# Altium schematic sheet MCU.SchDoc
size A4; SheetNumber: 4; SheetTotal: 6
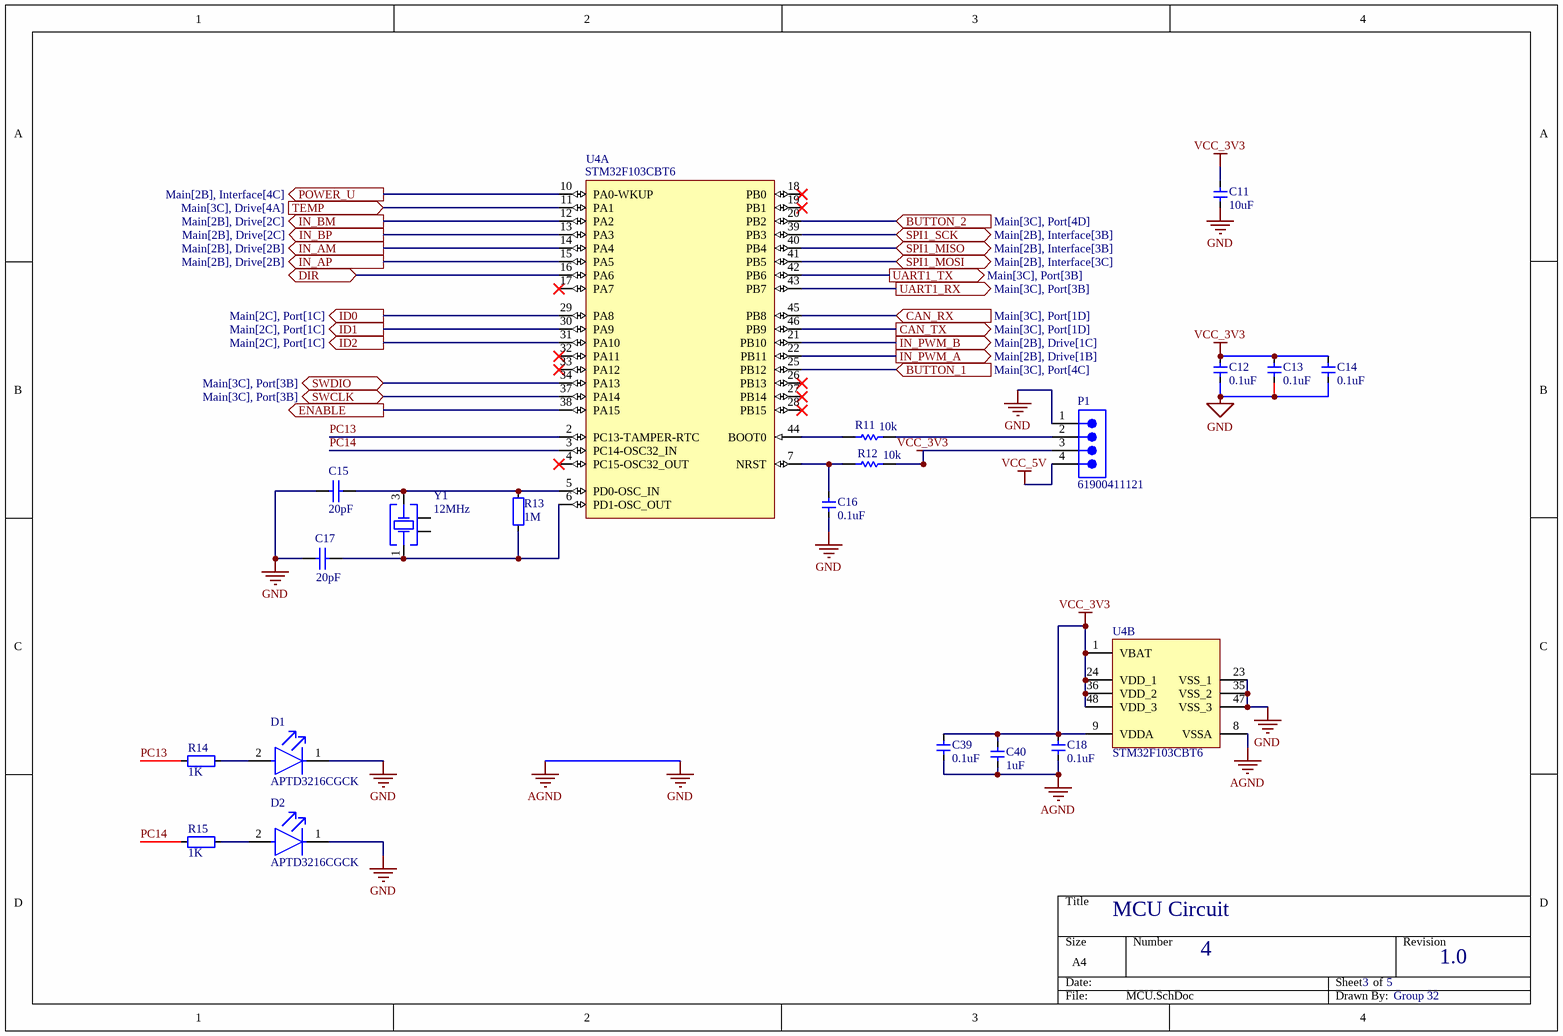
[diagram p0: MCU.SchDoc]

## Parts
C11  10uF  [CAPC2013X94X50LL20T25]
C12  0.1uF  [CAPC2013X94X50LL20T25]
C13  0.1uF  [CAPC2013X94X50LL20T25]
C14  0.1uF  [CAPC2013X94X50LL20T25]
C15  Resistance: 20pF  [CAPC2013X94X50LL20T25]  (hidden comment: 08055A200JAT2A)
C16  0.1uF  [CAPC2013X94X50LL20T25]
C17  Resistance: 20pF  [CAPC2013X94X50LL20T25]  (hidden comment: 08055A200JAT2A)
C18  0.1uF  [CAPC2013X94X50LL20T25]
C39  0.1uF  [CAPC2013X94X50LL20T25]
C40  1uF  [CAPC2013X94X50LL20T25]
D1  APTD3216CGCK  [FP-APTD3216CGCK-MFG]
D2  APTD3216CGCK  [FP-APTD3216CGCK-MFG]
P1  61900411121  [61900411121]
R11  REs: 10k  [RESC2013X60X35NL10T20]  (hidden comment: RC0805FR-0710KL)
R12  REs: 10k  [RESC2013X60X35NL10T20]  (hidden comment: RC0805FR-0710KL)
R13  1M  [RESC2013X60X35NL10T20]
R14  1K  [RESC3116X65N]
R15  1K  [RESC3116X65N]
U4  STM32F103CBT6  [STM-LQFP48_L]  (parts A,B of 2)
Y1  Frequency: 12MHz  [WE-XTAL_CFPX-180]  (hidden comment: 830069944)

## Ports
BUTTON_1 (in, see Main[3C], Port[4C]), BUTTON_2 (in, see Main[3C], Port[4D]), CAN_RX (in, see Main[3C], Port[1D]), CAN_TX (out, see Main[3C], Port[1D]), DIR (bidir), ENABLE (out), ID0 (out, see Main[2C], Port[1C]), ID1 (out, see Main[2C], Port[1C]), ID2 (out, see Main[2C], Port[1C]), IN_AM (out, see Main[2B], Drive[2B]), IN_AP (out, see Main[2B], Drive[2B]), IN_BM (out, see Main[2B], Drive[2C]), IN_BP (out, see Main[2B], Drive[2C]), IN_PWM_A (out, see Main[2B], Drive[1B]), IN_PWM_B (out, see Main[2B], Drive[1C]), POWER_U (out, see Main[2B], Interface[4C]), SPI1_MISO (bidir, see Main[2B], Interface[3B]), SPI1_MOSI (bidir, see Main[2B], Interface[3C]), SPI1_SCK (bidir, see Main[2B], Interface[3B]), SWCLK (bidir, see Main[3C], Port[3B]), SWDIO (bidir, see Main[3C], Port[3B]), TEMP (in, see Main[3C], Drive[4A]), UART1_RX (out, see Main[3C], Port[3B]), UART1_TX (out, see Main[3C], Port[3B])

## Nets
AGND: C11.1 C12.1 C13.1 C14.1 C15.1 C16.1 C17.1 C18.1 C39.1 C40.1 D1.1(C) D2.1(C) P1.1 U4.8(VSSA) U4.23(VSS_1) U4.35(VSS_2) U4.47(VSS_3)  [also labelled GND]
VCC_3V3: C11.2 C12.2 C13.2 C14.2 C18.2 C39.2 C40.2 P1.3 R12.2 U4.1(VBAT) U4.9(VDDA) U4.24(VDD_1) U4.36(VDD_2) U4.48(VDD_3)
VCC_5V: P1.4
BUTTON_1: U4.25(PB12) ; port BUTTON_1
BUTTON_2: U4.20(PB2) ; port BUTTON_2
CAN_RX: U4.45(PB8) ; port CAN_RX
CAN_TX: U4.46(PB9) ; port CAN_TX
DIR: U4.16(PA6) ; port DIR
ENABLE: U4.38(PA15) ; port ENABLE
ID0: U4.29(PA8) ; port ID0
ID1: U4.30(PA9) ; port ID1
ID2: U4.31(PA10) ; port ID2
IN_AM: U4.14(PA4) ; port IN_AM
IN_AP: U4.15(PA5) ; port IN_AP
IN_BM: U4.12(PA2) ; port IN_BM
IN_BP: U4.13(PA3) ; port IN_BP
IN_PWM_A: U4.22(PB11) ; port IN_PWM_A
IN_PWM_B: U4.21(PB10) ; port IN_PWM_B
PC13: R14.1 U4.2(PC13-TAMPER-RTC)
PC14: R15.1 U4.3(PC14-OSC32_IN)
POWER_U: U4.10(PA0-WKUP) ; port POWER_U
SPI1_MISO: U4.40(PB4) ; port SPI1_MISO
SPI1_MOSI: U4.41(PB5) ; port SPI1_MOSI
SPI1_SCK: U4.39(PB3) ; port SPI1_SCK
SWCLK: U4.37(PA14) ; port SWCLK
SWDIO: U4.34(PA13) ; port SWDIO
TEMP: U4.11(PA1) ; port TEMP
UART1_RX: U4.43(PB7) ; port UART1_RX
UART1_TX: U4.42(PB6) ; port UART1_TX
NetC15_2: C15.2 R13.2 U4.5(PD0-OSC_IN) Y1.3(Crystal)
NetC16_2: C16.2 R12.1 U4.7(NRST)
NetC17_2: C17.2 R13.1 U4.6(PD1-OSC_OUT) Y1.1(Crystal)
NetD1_2: D1.2(A) R14.2
NetD2_2: D2.2(A) R15.2
NetP1_2: P1.2 R11.2
NetR11_1: R11.1 U4.44(BOOT0)

Not connected (* = marked no-connect by the designer): U4 4(PC15-OSC32_OUT)* 17(PA7)* 18(PB0)* 19(PB1)* 26(PB13)* 27(PB14)* 28(PB15)* 32(PA11)* 33(PA12)*; Y1 2(GND&Lid) 4(GND&Lid)

## Notes on the sheet
- MCU Circuit
- 4
- 3
- 5
- 1.0
- Group 32

## Library data of the parts
C11-C14 C16 C18 C39 = 电容-0402: Capacitor; Value: 0.1u
C15 C17 = CMP-2007-04294-1: Manufacturer: AVX Interconnect / Elco; Part Number: 08055A200JAT2A
C40 = 电容-0402: Capacitor; Value: 1u
D1 D2 = CMP-2000-05792-2: LED GREEN CLEAR 2SMD; Forward Voltage: 2.1V; Forward Current: 20mA; Luminous Intensity: 300mcd; Number of LEDs: 1; Dominant Wavelength: 570nm; Viewing Angle: 50°; Lead Free: Lead Free; Lens Color: Clear; Mount: Surface Mount; Package Quantity: 2000; Height: 1.8mm; Number of Pins: 2; Test Current: 20mA; Case Code (Metric): 3216; Case/Package: 1206; Case Code (Imperial): 1206; Illumination Color: Green; Color: Green; Width: 1.6mm; Packaging: Tape and Reel; Min Operating Temperature: -40°C; Lens Style: Clear; Max Operating Temperature: 85°C; Length: 3.2mm
P1 = CMP-1502-00586-2: NexarPartId: 18818226; Connector Type: Male Pin; Insulation: Insulated; Number of Positions: 4; Gender: Male; Operating Supply Voltage: 250V; Pitch: 2.54mm; Current Rating: 3A; Insulation Resistance: 1GΩ; Contact Resistance: 20mΩ; Termination: Through Hole; Contact Material: Copper; Height: 3.3mm; Width: 10.2mm; RoHS: Compliant; REACH SVHC: Unknown; Max Operating Temperature: 105°C; Contact Plating: Tin; Lead Free: Lead Free; Contact Gender: Male; Lead Pitch: 2.54mm; Flammability Rating: UL94 V-0; Packaging: Bulk; Housing Material: Nylon; Number of Pins: 4; Number of Contacts: 4; Color: Beige; Number of Rows: 1; Orientation: Vertical; Contact Mating Length: 7.493mm; Mount: Through Hole; Min Operating Temperature: -40°C; Voltage Rating: 250V; Fastening Type: Friction; Length: 10.16mm
R11 R12 = CMP-1659-00013-4: Chip Resistor, 10 KOhm, +/- 1%, 0.125 W, -55 to 155 degC, 0805 (2012 Metric), RoHS, Tape and Reel; Manufacturer: Yageo; Voltage Rating: 150 V; Mount: Surface Mount; ComponentLink1Description: Manufacturer URL; ComponentLink2URL: http://www.yageo.com/documents/recent/PYu-RC_Group_51_RoHS_L_04.pdf; Pins: 2; Length: 2 mm; Min Operating Temperature: -55 degC; Height: 0.5 mm; Mounting Technology: Surface Mount; RoHSCompliant: true; REACH SVHC: No SVHC; ComponentLink1URL: http://www.yageo.com/; Max Operating Temperature: 155 degC; PackageReference: 0805; DatasheetVersion: Rev. 4, 02/2016; Package Quantity: 5000; Packaging: Tape and Reel; ComponentLink2Description: Datasheet; PackageDescription: 2-Pin Surface Mounted Device, Body 2 x 1.25 mm
R13-R15 = 电阻-0402: Resistor; Value: 22R
U4 = CMP-0237-00250-3: ARM Cortex-M3 32-bit MCU, 128 KB Flash, 20 KB Internal RAM, 37 I/Os, 48-pin LQFP, -40 to 85 degC, Tray; Supply Voltage(Vcc) min (V): 2; Operating Frequency(F) (Processor speed) (MHz): 72; A/D Converter: 2x12-bit (10 Channel); FLASH Size (Prog) (kB): 128; Internal RAM Size (kB): 20; I/Os (High Current): 37; ComponentLink2Description: Datasheet; PackageReference: LQFP48; PartNumber: STM32F103CBT6; ComponentLink1Description: Manufacturer URL; DatasheetVersion: Rev. 16; PackageVersion: Rev. 6, 06/2013; Packing: Tray; ComponentLink1URL: http://www.st.com/web/en/home.html; Mounting Technology: Surface Mount; ComponentLink3URL: http://www.st.com/st-web-ui/static/active/en/resource/technical/document/datasheet/DM00058181.pdf; PackageDescription: 48-Pin Low Profile Quad Flat Package, 7 x 7 mm Body, 0.5 mm Pitch; Core: ARM Cortex-M3; ComponentLink3Description: Package Specification; ComponentLink2URL: http://www.st.com/st-web-ui/static/active/en/resource/technical/document/datasheet/CD00161566.pdf
Y1 = CMP-03913-116876513-1: 830069944 WE-XTAL Quartz Crystal; Length: 3.2mm; Height: 800µm; Max Operating Temperature: 85°C; NexarPartId: 116876513; Min Operating Temperature: -40°C; Width: 2.5mm